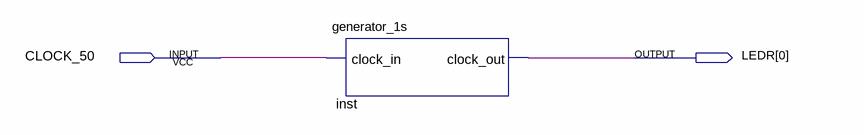
[diagram p0: schematic sheet]
// Quartus schematic generator_1s_test.bdf as structural Verilog: 1 symbols, 2 pins
module generator_1s_test (
  input  CLOCK_50,
  output [0:0] LEDR
);

  generator_1s inst (.clock_in(CLOCK_50), .clock_out(LEDR[0]));
endmodule
